# EAGLE design Esquematicodrivers (EAGLE 9.6.2)
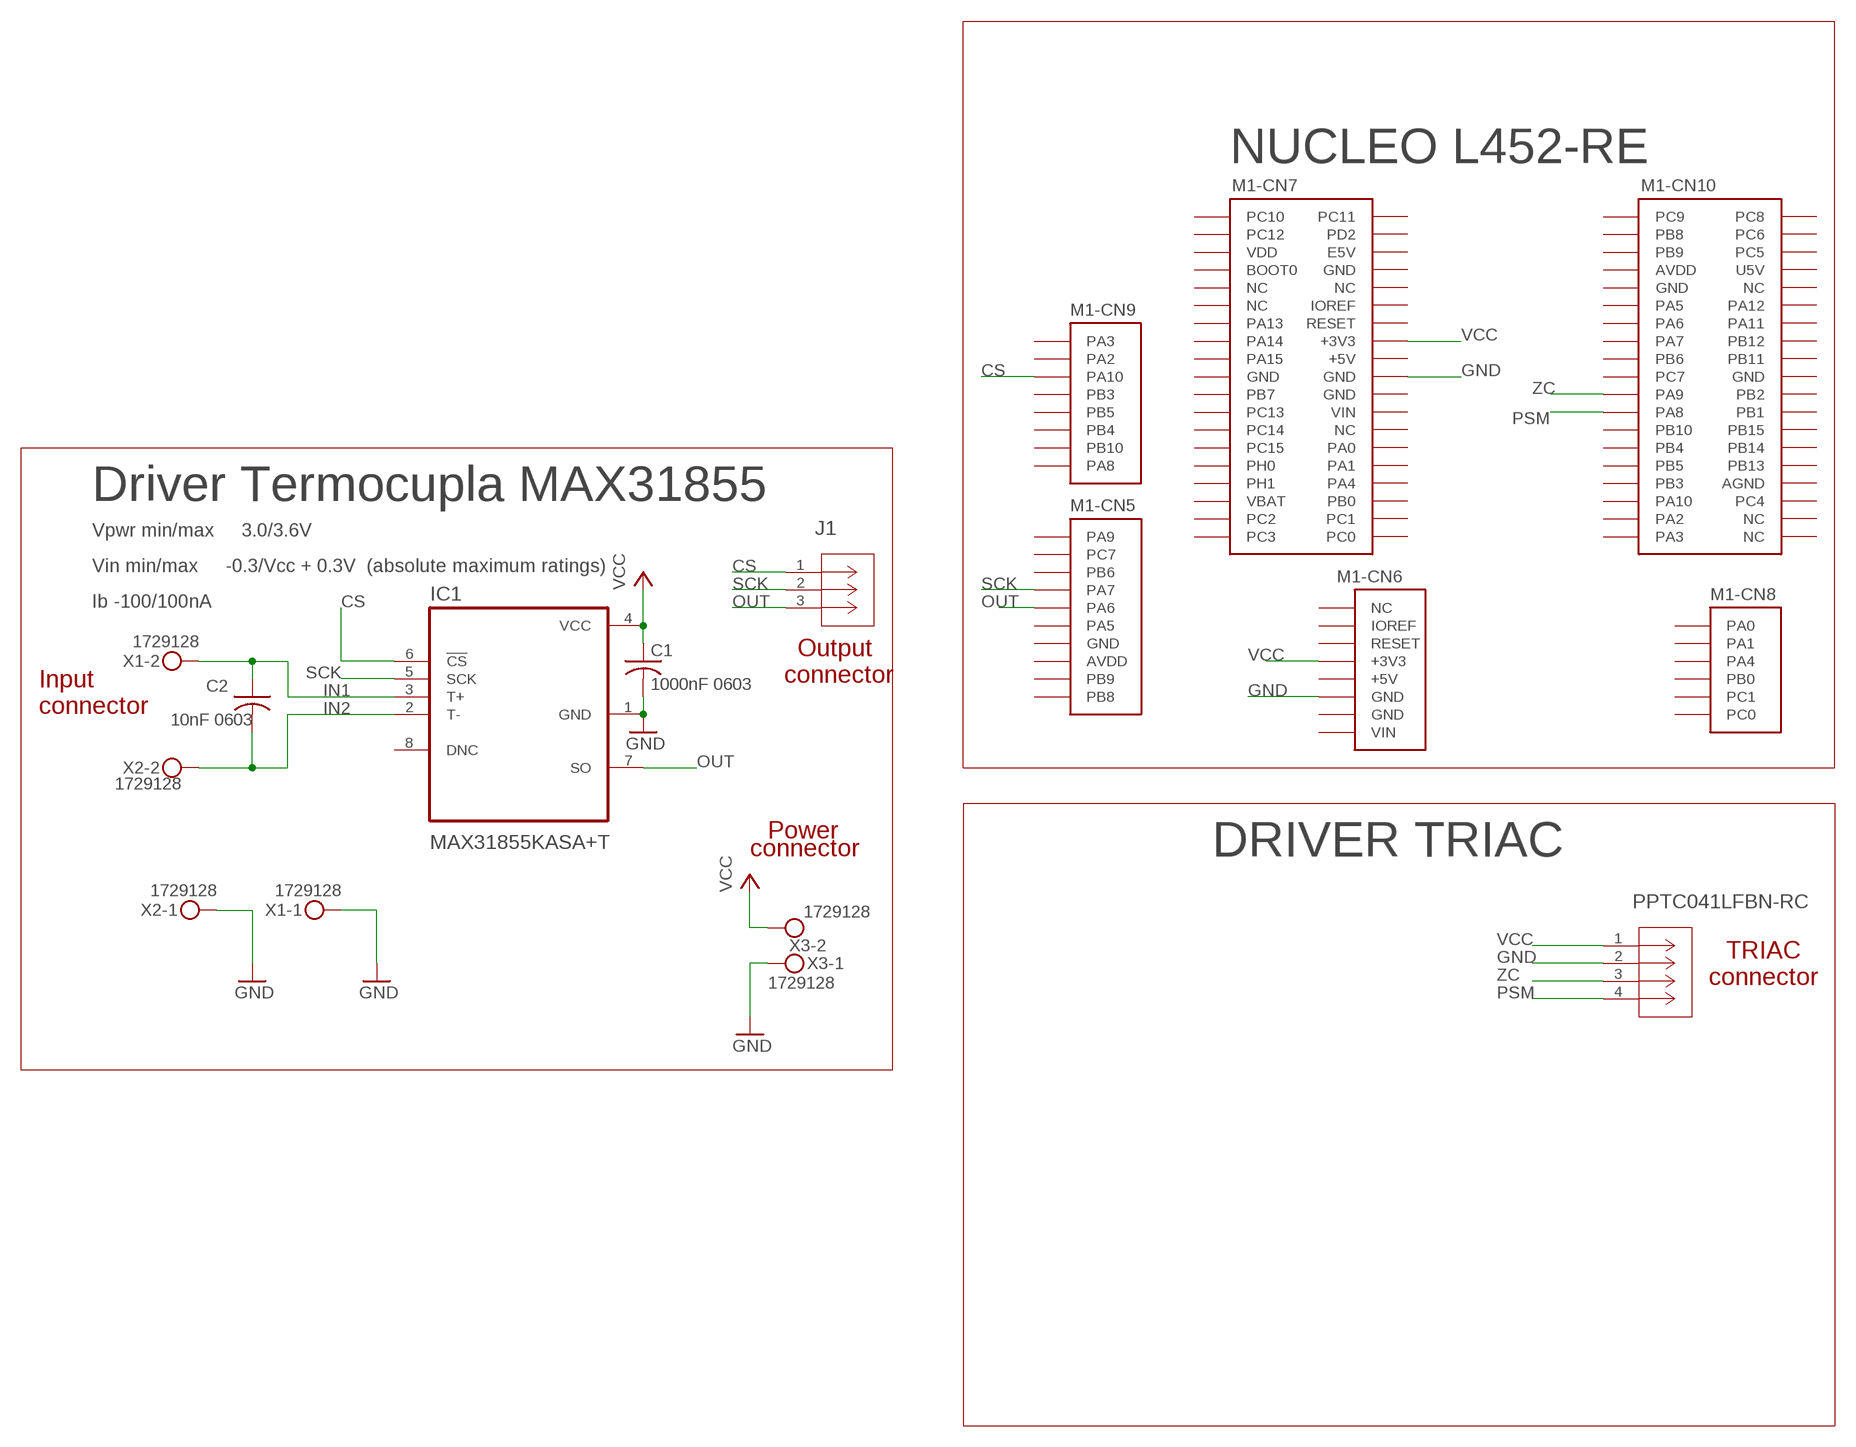
[diagram p0: schematic, sheet 1]

## Parts
C1  1000nF 0603  C-USC0603  [C0603]
C2  10nF 0603  C-USC0603  [C0603]
IC1  MAX31855KASA+T  [SOIC127P600X175-8N]
J1  PPPC031LFBN-RCCONN_PPPC031LFBN-RC_SUL  [CONN_PPPC031LFBN-RC_SUL]
M1  NUCLEO-L452RE  [NUCLEO-64]
PPTC041LFBN-RC  PPTC041LFBN-RCCONN_PPTC041LFBN-RC_SUL  [CONN_PPTC041LFBN-RC_SUL]
X1  1729128  MKDSN1,5/2-5,08  [MKDSN1,5/2-5,08]
X2  1729128  MKDSN1,5/2-5,08  [MKDSN1,5/2-5,08]
X3  1729128  MKDSN1,5/2-5,08  [MKDSN1,5/2-5,08]

## Nets
CS: IC1.6(!CS) J1.1 M1.CN9-3(-CN9:PA10)
GND: C1.2 IC1.1(GND) M1.CN6-6(-CN6:GND) M1.CN7-20(-CN7:GND) PPTC041LFBN-RC.2(GND) X1.1 X2.1 X3.1
IN1: C2.1 IC1.3(T+) X1.2
IN2: C2.2 IC1.2(T-) X2.2
OUT: IC1.7(SO) J1.3 M1.CN5-5(-CN5:PA6)
PSM: M1.CN10-23(-CN10:PA8) PPTC041LFBN-RC.4(PWM)
SCK: IC1.5(SCK) J1.2 M1.CN5-4(-CN5:PA7)
VCC: C1.1 IC1.4(VCC) M1.CN6-4(-CN6:+3V3) M1.CN7-16(-CN7:+3V3) PPTC041LFBN-RC.1(VCC) X3.2
ZC: M1.CN10-21(-CN10:PA9) PPTC041LFBN-RC.3(Z-C)
Unconnected: IC1.8(DNC) M1.CN5-1(-CN5:PA9) M1.CN5-2(-CN5:PC7) M1.CN5-3(-CN5:PB6) M1.CN5-6(-CN5:PA5) M1.CN5-9(-CN5:PB9) M1.CN5-10(-CN5:PB8) M1.CN6-1(-CN6:NC) M1.CN6-3(-CN6:RESET) M1.CN7-1(-CN7:PC10) M1.CN7-2(-CN7:PC11) M1.CN7-3(-CN7:PC12) M1.CN7-4(-CN7:PD2) M1.CN7-6(-CN7:E5V) M1.CN7-7(-CN7:BOOT0) M1.CN7-9(-CN7:NC) M1.CN7-10(-CN7:NC) M1.CN7-11(-CN7:NC) M1.CN7-12(-CN7:IOREF) M1.CN7-13(-CN7:PA13) M1.CN7-14(-CN7:RESET) M1.CN7-15(-CN7:PA14) M1.CN7-17(-CN7:PA15) M1.CN7-21(-CN7:PB7) M1.CN7-23(-CN7:PC13) M1.CN7-25(-CN7:PC14) M1.CN7-26(-CN7:NC) M1.CN7-27(-CN7:PC15) M1.CN7-28(-CN7:PA0) M1.CN7-29(-CN7:PH0) M1.CN7-30(-CN7:PA1) M1.CN7-31(-CN7:PH1) M1.CN7-32(-CN7:PA4) M1.CN7-34(-CN7:PB0) M1.CN7-35(-CN7:PC2) M1.CN7-36(-CN7:PC1) M1.CN7-37(-CN7:PC3) M1.CN7-38(-CN7:PC0) M1.CN8-1(-CN8:PA0) M1.CN8-2(-CN8:PA1) M1.CN8-3(-CN8:PA4) M1.CN8-4(-CN8:PB0) M1.CN8-5(-CN8:PC1) M1.CN8-6(-CN8:PC0) M1.CN9-1(-CN9:PA3) M1.CN9-2(-CN9:PA2) M1.CN9-4(-CN9:PB3) M1.CN9-5(-CN9:PB5) M1.CN9-6(-CN9:PB4) M1.CN9-7(-CN9:PB10) M1.CN9-8(-CN9:PA8) M1.CN10-1(-CN10:PC9) M1.CN10-2(-CN10:PC8) M1.CN10-3(-CN10:PB8) M1.CN10-4(-CN10:PC6) M1.CN10-5(-CN10:PB9) M1.CN10-6(-CN10:PC5) M1.CN10-10(-CN10:NC) M1.CN10-11(-CN10:PA5) M1.CN10-12(-CN10:PA12) M1.CN10-13(-CN10:PA6) M1.CN10-14(-CN10:PA11) M1.CN10-15(-CN10:PA7) M1.CN10-16(-CN10:PB12) M1.CN10-17(-CN10:PB6) M1.CN10-18(-CN10:PB11) M1.CN10-19(-CN10:PC7) M1.CN10-22(-CN10:PB2) M1.CN10-24(-CN10:PB1) M1.CN10-25(-CN10:PB10) M1.CN10-26(-CN10:PB15) M1.CN10-27(-CN10:PB4) M1.CN10-28(-CN10:PB14) M1.CN10-29(-CN10:PB5) M1.CN10-30(-CN10:PB13) M1.CN10-31(-CN10:PB3) M1.CN10-33(-CN10:PA10) M1.CN10-34(-CN10:PC4) M1.CN10-35(-CN10:PA2) M1.CN10-36(-CN10:NC) M1.CN10-37(-CN10:PA3) M1.CN10-38(-CN10:NC)

## Notes on the sheet
- NUCLEO L452-RE
- Driver Termocupla MAX31855
- Vpwr min/max     3.0/3.6V
- Vin min/max     -0.3/Vcc + 0.3V  (absolute maximum ratings)
- Ib -100/100nA
- Output 
  connector
- Input
  connector
- Power
- connector | DRIVER TRIAC
- TRIAC
  connector

## Power pins joined to a net without a drawn wire
+5V: M1.CN6-5(-CN6:+5V) M1.CN7-18(-CN7:+5V)
AGND: M1.CN10-32(-CN10:AGND)
AVDD: M1.CN5-8(-CN5:AVDD) M1.CN10-7(-CN10:AVDD)
GND: M1.CN5-7(-CN5:GND) M1.CN6-7(-CN6:GND) M1.CN7-8(-CN7:GND) M1.CN7-19(-CN7:GND) M1.CN7-22(-CN7:GND) M1.CN10-9(-CN10:GND) M1.CN10-20(-CN10:GND)
IOREF: M1.CN6-2(-CN6:IOREF)
U5V: M1.CN10-8(-CN10:U5V)
VBAT: M1.CN7-33(-CN7:VBAT)
VDD: M1.CN7-5(-CN7:VDD)
VIN: M1.CN6-8(-CN6:VIN) M1.CN7-24(-CN7:VIN)

## Library data of the parts
C1 = rcl:C-US: CAPACITOR, American symbol; PARTNO: CC0603KRX7R7BB104; SPICEPREFIX: C
C2 = rcl:C-US: CAPACITOR, American symbol; PARTNO: GRM033R71A103KA01D; SPICEPREFIX: C
IC1 = MAX31855KASA+T-DK:MAX31855KASA+T; PARTNO: MAX31855KASA+T
J1 = PPPC031LFBN-RC:PPPC031LFBN-RC; COPYRIGHT: Copyright (C) 2023 Ultra Librarian. All rights reserved.; MANUFACTURER_PART_NUMBER: PPPC031LFBN-RC; MFR_NAME: Sullins; PARTNO: PPPC031LFBN-RC
M1 = NUCLEO-L452RE:NUCLEO-L452RE: No existe un outline (Layer Dimension) para esta librería. En su lugar se utilizó una referencia en tDocu. Al momento de diseñar la tarjeta, el Dimension debe ser dibujado según los requerimientos del usuario, o simplemente copiar los contenidos del tDocu en Dimensions.
PPTC041LFBN-RC = PPTC041LFBN-RC:PPTC041LFBN-RC; COPYRIGHT: Copyright (C) 2023 Ultra Librarian. All rights reserved.; MANUFACTURER_PART_NUMBER: PPTC041LFBN-RC; MFR_NAME: Sullins; PARTNO: PPTC041LFBN-RC
X1-X3 = 1729128-PHOENIX CONTACT:MKDSN1,5/2-5,08: MKDSN 1,5/ 2-5,08 Printklemme Nennstrom: 13,5 A Nennspannung: 250 V Rastermaß: 5,08 mm Polzahl: 2 Anschlussart: Schraubanschluss Montage: Löten Anschlussrichtung Leiter/Platine: 0 ° Artikelnummer: 1729128 Source: http://eshop.phoenixcontact.com .. 1729128.pdf; PARTNO: 1729128

## Board
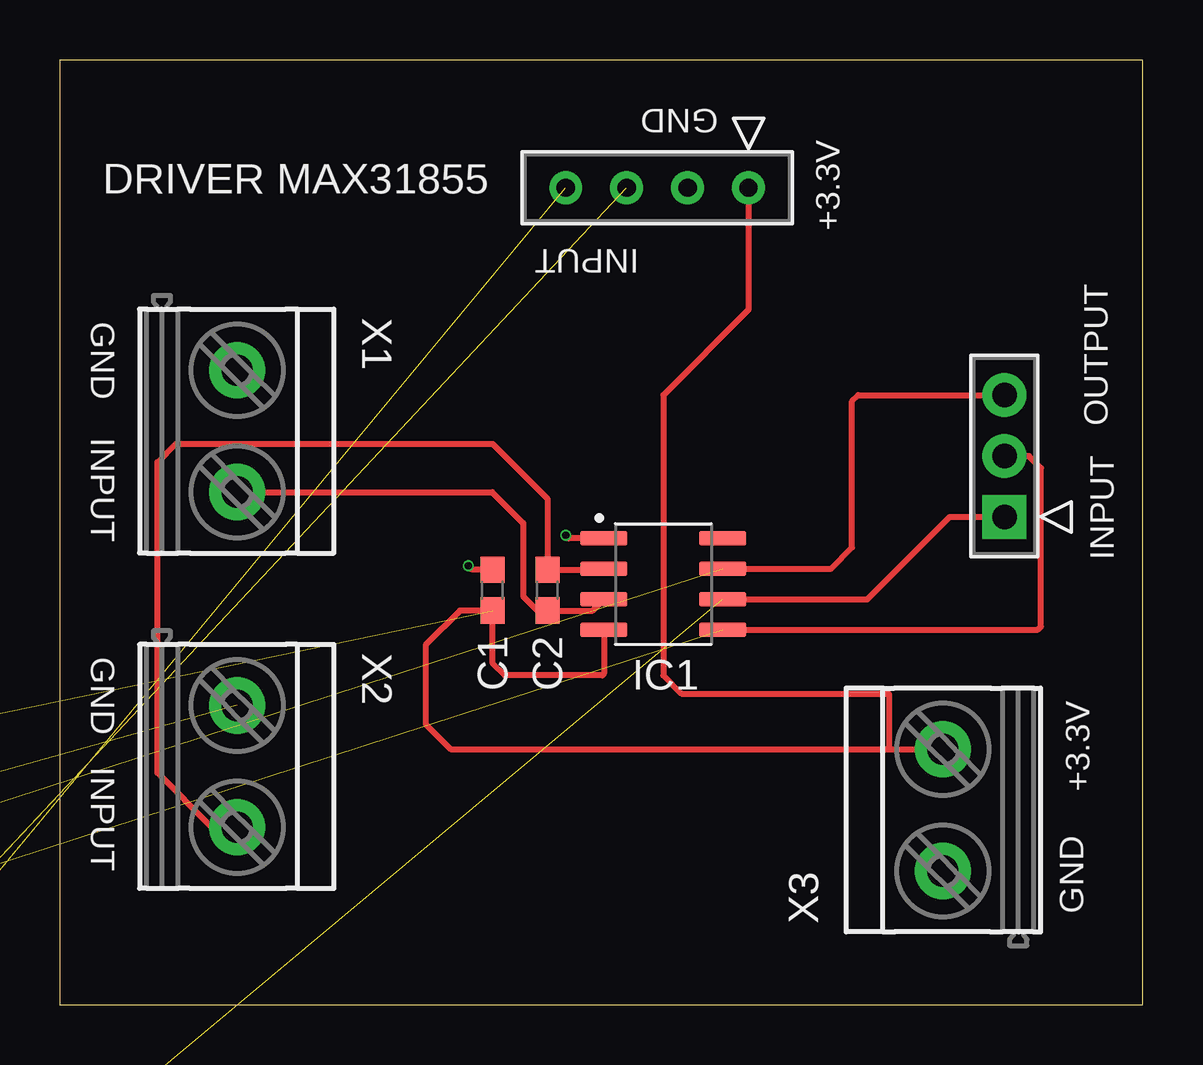
[diagram p1: board, top side]
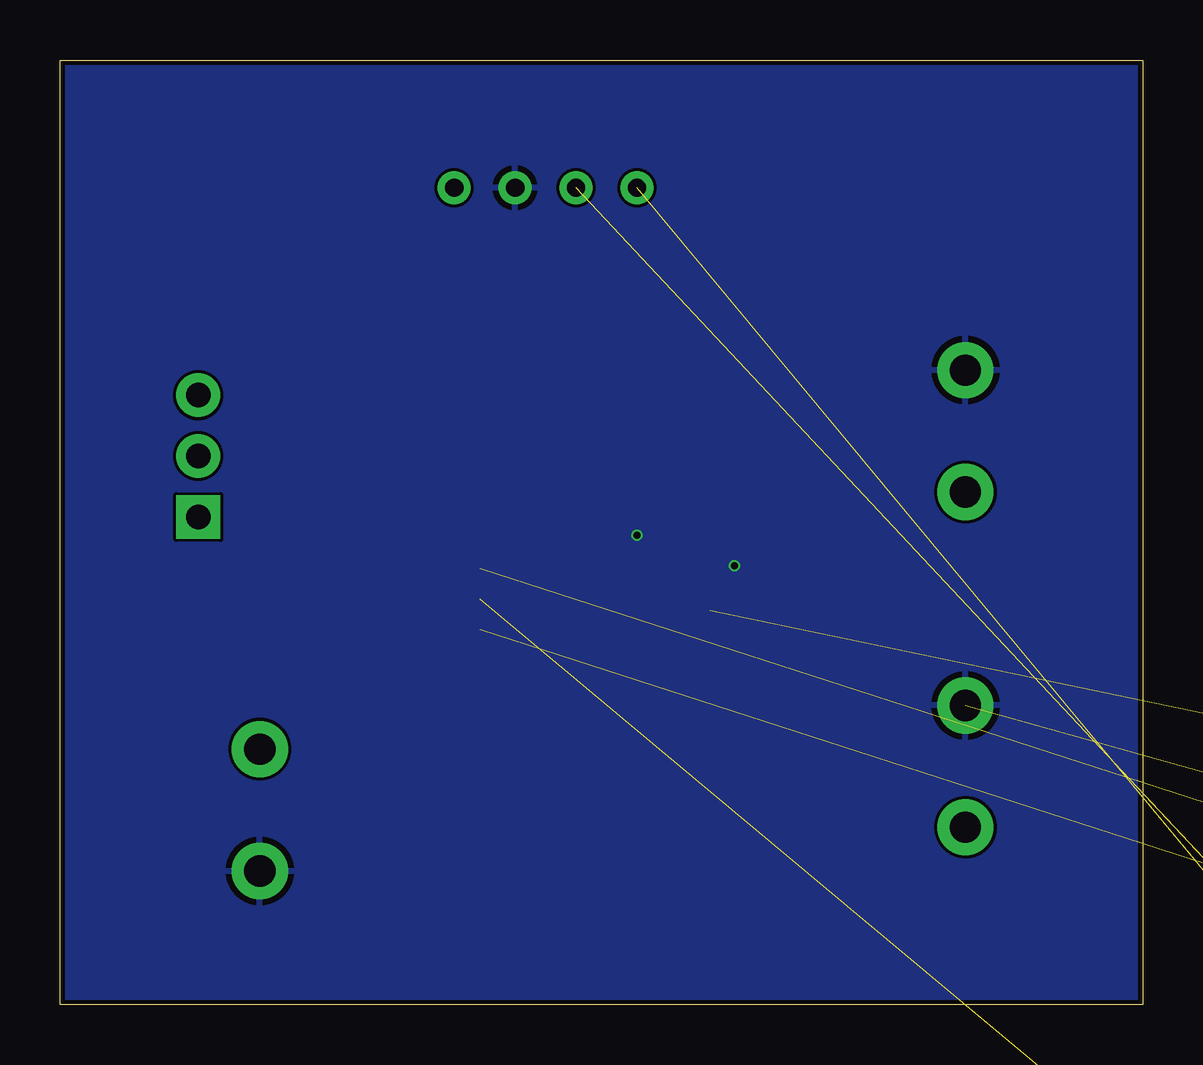
[diagram p2: board, bottom side, seen from below]

Size 45.14 x 39.36 mm. Coordinates in mm from the lower left corner, seen from the top.
Outline: 0,0 45.14,0 45.14,39.36 0,39.36 0,0
Copper layers (1*16): Top 0.035mm / dielectric 1.6mm / Bottom 0.035mm
Design rules "jlcpcb-2layers *": minimum track width 5mil, minimum drill 0.3mm, track to track 5mil, track to pad 5mil, pad to pad 5mil, via to via 5mil, smd to smd 5mil, copper to edge 0.2mm, drill to drill 6mil, minimum pad ring 10mil, minimum via ring 3mil, stop-mask expansion 4mil, vias tented up to drill 15mil, thermal gap 10mil

### Footprints (pad centres in the part's own frame; a part is rotated, then mirrored left to right if it is on the bottom)
C0603 = smd 1.1 x 1: 1 -0.85,0; 2 0.85,0
SOIC127P600X175-8N = smd 1.97 x 0.59: 1 -2.475,1.905; 2 -2.475,0.635; 3 -2.475,-0.635; 4 -2.475,-1.905; 5 2.475,-1.905; 6 2.475,-0.635; 7 2.475,0.635; 8 2.475,1.905
CONN_PPPC031LFBN-RC_SUL = drill 1.016 pad 1.524 square: 1 0,0 | drill 1.016 pad 1.524: 2 -2.54,0; 3 -5.08,0
NUCLEO-64 = drill 1.1 pad 1.85 square: CN5-1 59.13,24.884; CN6-1 10.87,38.6; CN7-1 3.25,48.76; CN8-1 10.87,15.74; CN9-1 59.13,3.04; CN10-1 64.21,48.735 | drill 1.1 pad 1.85: CN5-2 59.13,27.424; CN5-3 59.13,29.964; CN5-4 59.13,32.504; CN5-5 59.13,35.044; CN5-6 59.13,37.584; CN5-7 59.13,40.124; CN5-8 59.13,42.664; CN5-9 59.13,45.204; CN5-10 59.13,47.744; CN6-2 10.87,36.06; CN6-3 10.87,33.52; CN6-4 10.87,30.98; CN6-5 10.87,28.44; CN6-6 10.87,25.9; CN6-7 10.87,23.36; CN6-8 10.87,20.82; CN7-2 5.79,48.76; CN7-3 3.25,46.22; CN7-4 5.79,46.22; CN7-5 3.25,43.68; CN7-6 5.79,43.68; CN7-7 3.25,41.14; CN7-8 5.79,41.14; CN7-9 3.25,38.6; CN7-10 5.79,38.6; CN7-11 3.25,36.06; CN7-12 5.79,36.06; CN7-13 3.25,33.52; CN7-14 5.79,33.52; CN7-15 3.25,30.98; CN7-16 5.79,30.98; CN7-17 3.25,28.44; CN7-18 5.79,28.44; CN7-19 3.25,25.9; CN7-20 5.79,25.9; CN7-21 3.25,23.36; CN7-22 5.79,23.36; CN7-23 3.25,20.82; CN7-24 5.79,20.82; CN7-25 3.25,18.28; CN7-26 5.79,18.28; CN7-27 3.25,15.74; CN7-28 5.79,15.74; CN7-29 3.25,13.2; CN7-30 5.79,13.2; CN7-31 3.25,10.66; CN7-32 5.79,10.66; CN7-33 3.25,8.12; CN7-34 5.79,8.12; CN7-35 3.25,5.58; CN7-36 5.79,5.58; CN7-37 3.25,3.04; CN7-38 5.79,3.04; CN8-2 10.87,13.2; CN8-3 10.87,10.66; CN8-4 10.87,8.12; CN8-5 10.87,5.58; CN8-6 10.87,3.04; CN9-2 59.13,5.58; CN9-3 59.13,8.12; CN9-4 59.13,10.66; CN9-5 59.13,13.2; CN9-6 59.13,15.74; CN9-7 59.13,18.28; CN9-8 59.13,20.82; CN10-2 66.75,48.735; CN10-3 64.21,46.195; CN10-4 66.75,46.195; CN10-5 64.21,43.655; CN10-6 66.75,43.655; CN10-7 64.21,41.115; CN10-8 66.75,41.115; CN10-9 64.21,38.575; CN10-10 66.75,38.575; CN10-11 64.21,36.035; CN10-12 66.75,36.035; CN10-13 64.21,33.495; CN10-14 66.75,33.495; CN10-15 64.21,30.955; CN10-16 66.75,30.955; CN10-17 64.21,28.415; CN10-18 66.75,28.415; CN10-19 64.21,25.875; CN10-20 66.75,25.875; CN10-21 64.21,23.335; CN10-22 66.75,23.335; CN10-23 64.21,20.795; CN10-24 66.75,20.795; CN10-25 64.21,18.255; CN10-26 66.75,18.255; CN10-27 64.21,15.715; CN10-28 66.75,15.715; CN10-29 64.21,13.175; CN10-30 66.75,13.175; CN10-31 64.21,10.635; CN10-32 66.75,10.635; CN10-33 64.21,8.095; CN10-34 66.75,8.095; CN10-35 64.21,5.555; CN10-36 66.75,5.555; CN10-37 64.21,3.015; CN10-38 66.75,3.015 | hole 3.175: 59.13,51.3; 10.87,52.57; 43.89,0.5
CONN_PPTC041LFBN-RC_SUL = drill 0.762 pad 1.27: 1 0,0; 2 -2.54,0; 3 -5.08,0; 4 -7.62,0
MKDSN1,5/2-5,08 = drill 1.3 pad 2: 1 -2.561,0.025; 2 2.519,0.025

### Placement (x,y rotation side)
C1  18.03,17.27 90 top
C2  20.32,17.27 90 top
IC1  25.15,17.53 0 top
J1  39.37,20.32 270 top
M1  -81.53,-33.02 0 top  (outside the outline)
PPTC041LFBN-RC  28.7,34.04 0 top
X1  7.37,23.88 270 top
X2  7.37,9.91 270 top
X3  36.83,8.13 90 top

### Tracks (layer width: path | path; a pad name or v marks a point on that pad's centre or on a via)
+5V  (1 unrouted)
AVDD  (1 unrouted)
CS  (1 unrouted)
  Top 0.254: IC1.6 33.66,16.89 37.08,20.32 J1.1
GND  (via drill 0.3)  (9 unrouted)
  Top 0.254: IC1.1 21.21,19.43 v21.08,19.56 | C1.2 17.18,18.12 v17.02,18.29
  pour Bottom: 0,39.37 43.43,39.37 43.43,0 0,0
  pour Bottom: 1.52,39.37 45.21,39.37 45.21,0 1.52,0
IN1
  Top 0.254: X1.2 18.01,21.36 19.3,20.07 19.3,17.02 19.9,16.42 C2.1 22.2,16.42 IC1.3
IN2
  Top 0.254: X2.2 6.33,7.39 4.06,9.65 4.06,22.61 4.83,23.37 18.03,23.37 20.32,21.08 C2.2 21.76,18.12 21.84,18.03 22.54,18.03 IC1.2
OUT  (1 unrouted)
  Top 0.254: IC1.7 32.13,18.16 33.02,19.05 33.02,25.15 33.27,25.4 J1.3
PSM  (1 unrouted)
SCK  (1 unrouted)
  Top 0.254: IC1.5 40.77,15.62 40.89,15.75 40.89,22.35 40.39,22.86 J1.2
VCC  (2 unrouted)
  Top 0.254: IC1.4 22.67,13.78 22.61,13.72 18.54,13.72 18.03,14.22 C1.1 16.68,16.42 15.24,14.99 15.24,11.68 16.28,10.65 34.54,10.65 | 34.54,10.65 X3.2 | PPTC041LFBN-RC.1 28.7,28.96 25.15,25.4 25.15,13.72 25.91,12.95 34.54,12.95 34.54,10.65
VIN  (1 unrouted)
ZC  (1 unrouted)

### Text on the board
tPlace: GND | DRIVER MAX31855 | +3.3V | INPUT | GND | OUTPUT | INPUT | INPUT | GND | INPUT | +3.3V | GND